# Altium schematic sheet Esquema_V2.SchDoc
size A3; SheetNumber: 1; SheetTotal: 2
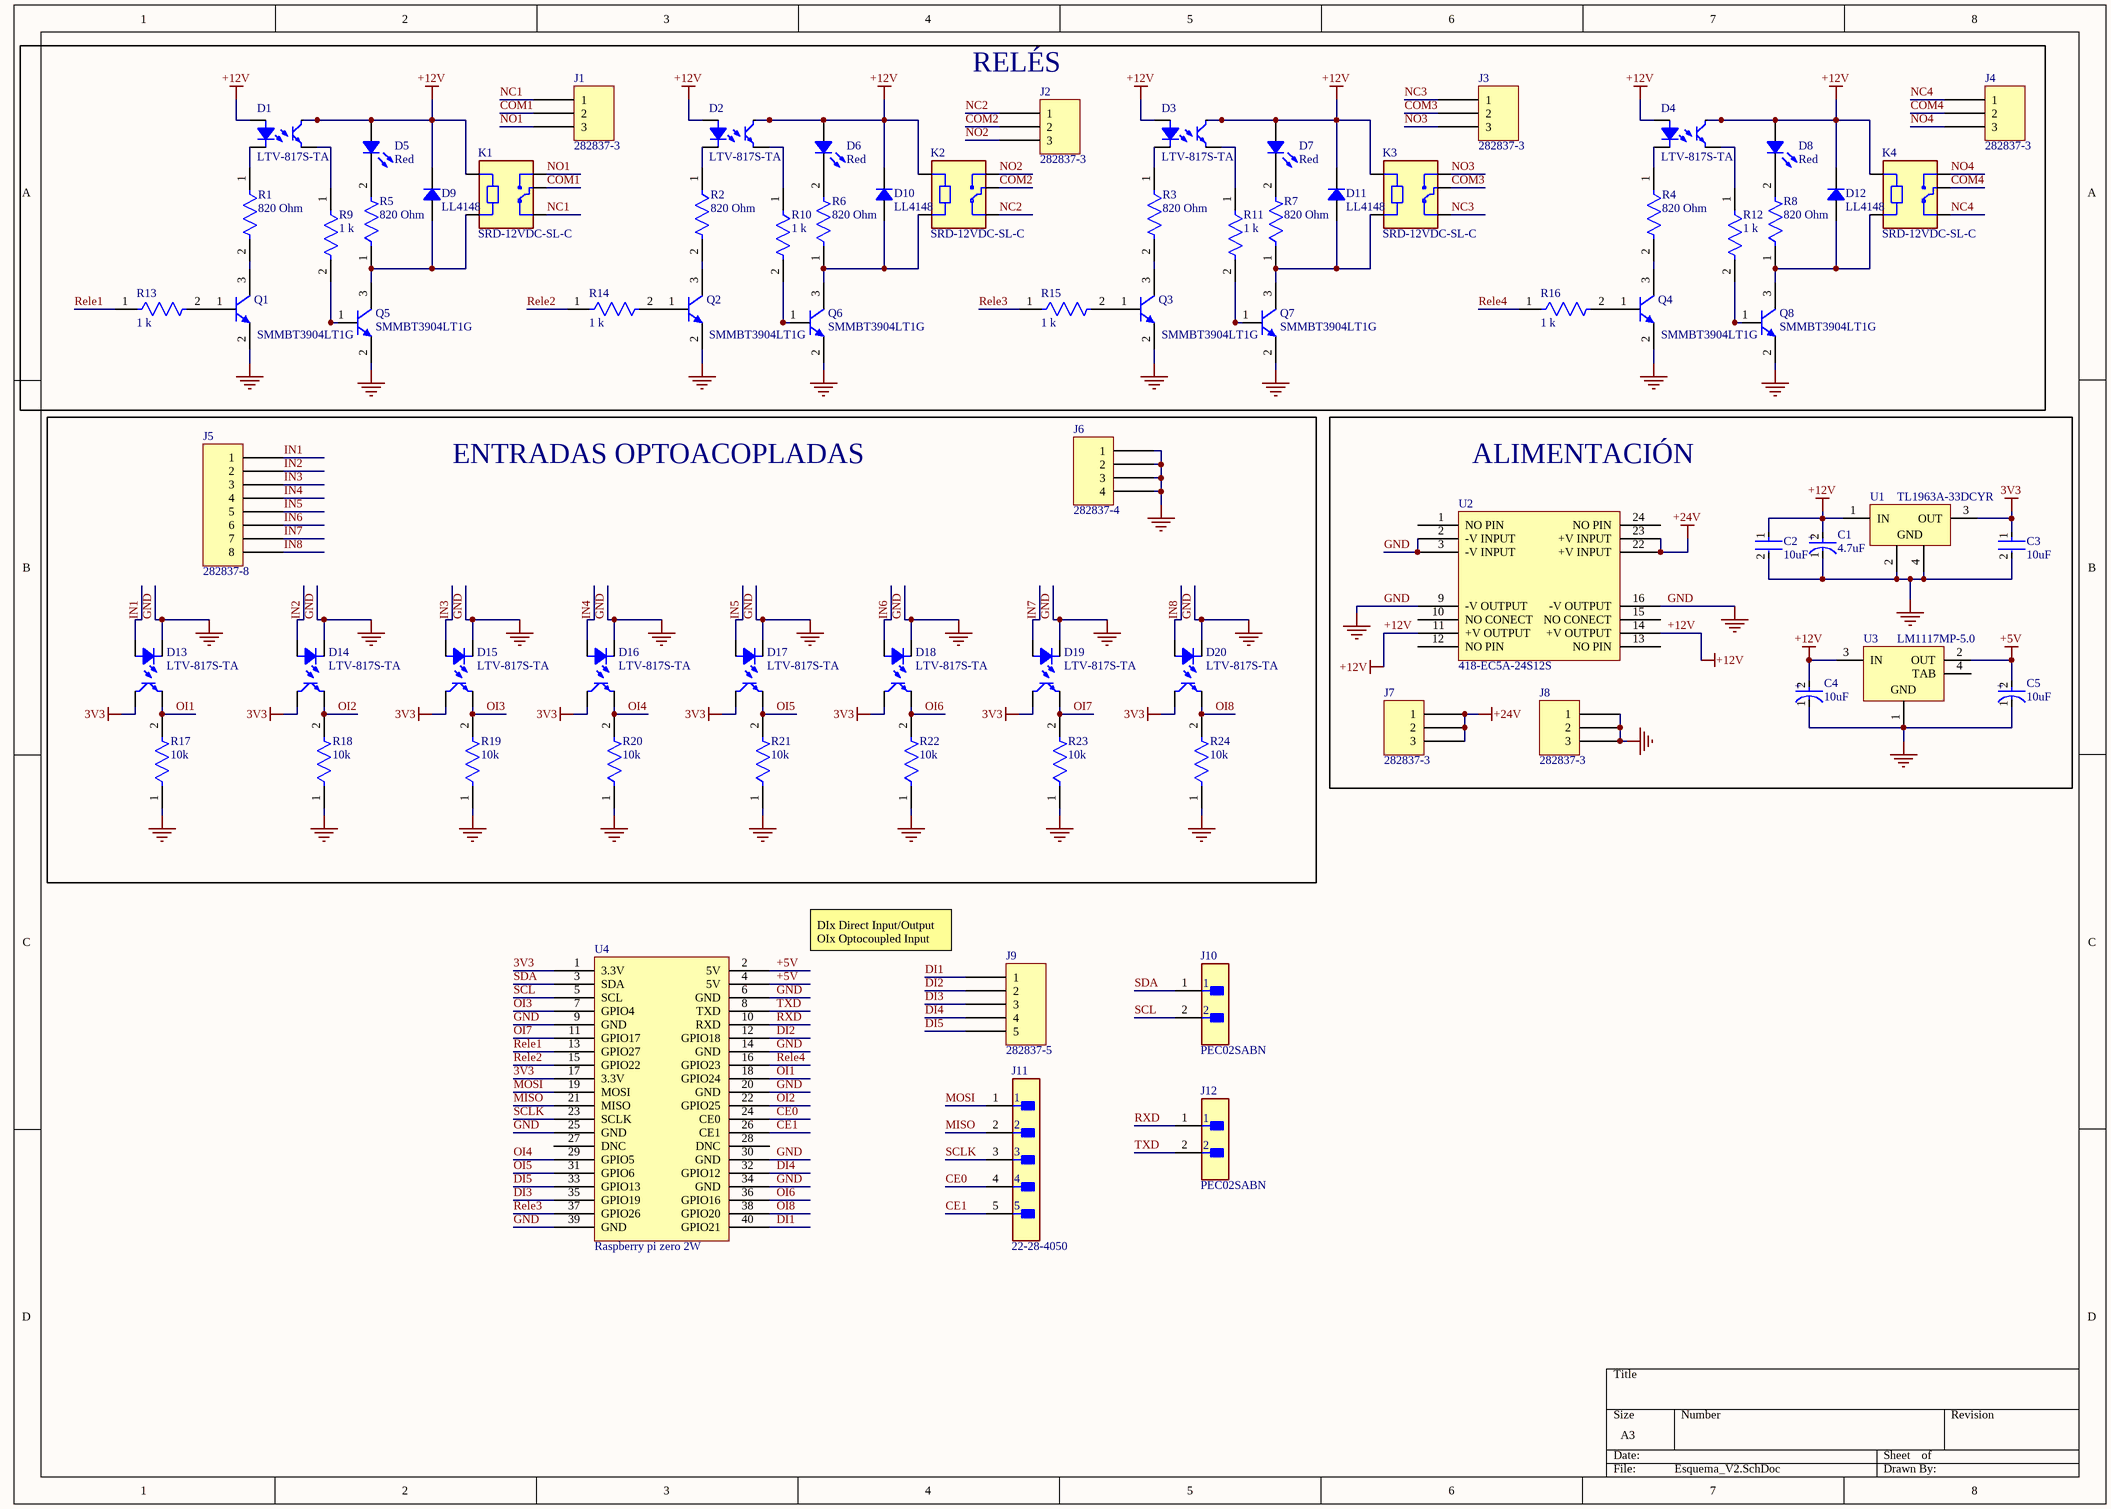
[diagram p0: Esquema_V2.SchDoc]

## Parts
C1  4.7uF  [FP-T491A475M016AT-MFG]
C2  10uF  [FP-C2012-125-0_2-IPC_B]
C3  10uF  [FP-C2012-125-0_2-IPC_B]
C4  10uF  [FP-TAJA-MFG]
C5  10uF  [FP-TAJA-MFG]
D1  LTV-817S-TA  [LITEON LTV-817]
D2  LTV-817S-TA  [LITEON LTV-817]
D3  LTV-817S-TA  [LITEON LTV-817]
D4  LTV-817S-TA  [LITEON LTV-817]
D5  Red  [LED 1206_3216 RED]
D6  Red  [LED 1206_3216 RED]
D7  Red  [LED 1206_3216 RED]
D8  Red  [LED 1206_3216 RED]
D9  LL4148  [SOD-80 MiniMELF]
D10  LL4148  [SOD-80 MiniMELF]
D11  LL4148  [SOD-80 MiniMELF]
D12  LL4148  [SOD-80 MiniMELF]
D13  LTV-817S-TA  [LITEON LTV-817]
D14  LTV-817S-TA  [LITEON LTV-817]
D15  LTV-817S-TA  [LITEON LTV-817]
D16  LTV-817S-TA  [LITEON LTV-817]
D17  LTV-817S-TA  [LITEON LTV-817]
D18  LTV-817S-TA  [LITEON LTV-817]
D19  LTV-817S-TA  [LITEON LTV-817]
D20  LTV-817S-TA  [LITEON LTV-817]
J1  282837-3  [TE 282837-3]
J2  282837-3  [TE 282837-3]
J3  282837-3  [TE 282837-3]
J4  282837-3  [TE 282837-3]
J5  282837-8  [TE 282837-8]
J6  282837-4  [TE 282837-4]
J7  282837-3  [TE 282837-3]
J8  282837-3  [TE 282837-3]
J9  282837-5  [TE 282837-5]
J10  PEC02SABN  [FP-PEC02SABN-MFG]
J11  22-28-4050  [FP-22-28-4050-MFG]
J12  PEC02SABN  [FP-PEC02SABN-MFG]
K1  SRD-12VDC-SL-C  [RELAY_SRD-05VDC-SL-C]
K2  SRD-12VDC-SL-C  [RELAY_SRD-05VDC-SL-C]
K3  SRD-12VDC-SL-C  [RELAY_SRD-05VDC-SL-C]
K4  SRD-12VDC-SL-C  [RELAY_SRD-05VDC-SL-C]
Q1  SMMBT3904LT1G  [ONSC-SOT-23-3-318-08_V]
Q2  SMMBT3904LT1G  [ONSC-SOT-23-3-318-08_V]
Q3  SMMBT3904LT1G  [ONSC-SOT-23-3-318-08_V]
Q4  SMMBT3904LT1G  [ONSC-SOT-23-3-318-08_V]
Q5  SMMBT3904LT1G  [ONSC-SOT-23-3-318-08_V]
Q6  SMMBT3904LT1G  [ONSC-SOT-23-3-318-08_V]
Q7  SMMBT3904LT1G  [ONSC-SOT-23-3-318-08_V]
Q8  SMMBT3904LT1G  [ONSC-SOT-23-3-318-08_V]
R1  820 Ohm  [FP-CRCW0603-HPe3-MFG]
R2  820 Ohm  [FP-CRCW0603-HPe3-MFG]
R3  820 Ohm  [FP-CRCW0603-HPe3-MFG]
R4  820 Ohm  [FP-CRCW0603-HPe3-MFG]
R5  820 Ohm  [FP-CRCW0603-HPe3-MFG]
R6  820 Ohm  [FP-CRCW0603-HPe3-MFG]
R7  820 Ohm  [FP-CRCW0603-HPe3-MFG]
R8  820 Ohm  [FP-CRCW0603-HPe3-MFG]
R9  1 k  [FP-MCT0603-IPC_C]
R10  1 k  [FP-MCT0603-IPC_C]
R11  1 k  [FP-MCT0603-IPC_C]
R12  1 k  [FP-MCT0603-IPC_C]
R13  1 k  [FP-MCT0603-IPC_C]
R14  1 k  [FP-MCT0603-IPC_C]
R15  1 k  [FP-MCT0603-IPC_C]
R16  1 k  [FP-MCT0603-IPC_C]
R17  10k  [FP-MCT0603-IPC_B]
R18  10k  [FP-MCT0603-IPC_B]
R19  10k  [FP-MCT0603-IPC_B]
R20  10k  [FP-MCT0603-IPC_B]
R21  10k  [FP-MCT0603-IPC_B]
R22  10k  [FP-MCT0603-IPC_B]
R23  10k  [FP-MCT0603-IPC_B]
R24  10k  [FP-MCT0603-IPC_B]
U1  TL1963A-33DCYR  [DCY0004A_N]
U2  418-EC5A-24S12S  [418-EC5A-24S12S]
U3  LM1117MP-5.0  [MP04A_N]
U4  Raspberry pi zero 2W  [PCBComponent_1]

## Blocks framed on the sheet
RELÉS: D1-D12 J1-J4 K1-K4 Q1-Q8 R1-R16
ENTRADAS OPTOACOPLADAS: D13-D20 J5 J6 R17-R24
ALIMENTACIÓN: C1-C5 J7 J8 U1-U3

## Nets
3V3: C3.1 D13.4 D14.4 D15.4 D16.4 D17.4 D18.4 D19.4 D20.4 U1.3(OUT) U4.1(3.3V) U4.17(3.3V)
+5V: C5.2(A) U3.2(OUT) U4.2(5V) U4.4(5V)
+12V: C1.2(A) C2.1 C4.2(A) D1.1 D1.4 D2.1 D2.4 D3.1 D3.4 D4.1 D4.4 D5.1 D6.1 D7.1 D8.1 D9.2 D10.2 D11.2 D12.2 K1.A1 K2.A1 K3.A1 K4.A1 U1.1(IN) U2.11(+V_OUTPUT) U2.14(+V_OUTPUT) U3.3(IN)
+24V: J7.1 J7.2 J7.3 U2.22(+V_INPUT) U2.23(+V_INPUT)
GND: C1.1(C) C2.2 C3.2 C4.1(C) C5.1(C) D13.2 D14.2 D15.2 D16.2 D17.2 D18.2 D19.2 D20.2 J6.1 J6.2 J6.3 J6.4 J8.1 J8.2 J8.3 Q1.2(E) Q2.2(E) Q3.2(E) Q4.2(E) Q5.2(E) Q6.2(E) Q7.2(E) Q8.2(E) R17.1 R18.1 R19.1 R20.1 R21.1 R22.1 R23.1 R24.1 U1.2(GND) U1.4(GND) U2.2(-V_INPUT) U2.3(-V_INPUT) U2.9(-V_OUTPUT) U2.16(-V_OUTPUT) U3.1(GND) U4.6(GND) U4.9(GND) U4.14(GND) U4.20(GND) U4.25(GND) U4.30(GND) U4.34(GND) U4.39(GND)
CE0: J11.4 U4.24(CE0)
CE1: J11.5 U4.26(CE1)
COM1: J1.2 K1.COM
COM2: J2.2 K2.COM
COM3: J3.2 K3.COM
COM4: J4.2 K4.COM
DI1: J9.1 U4.40(GPIO21)
DI2: J9.2 U4.12(GPIO18)
DI3: J9.3 U4.35(GPIO19)
DI4: J9.4 U4.32(GPIO12)
DI5: J9.5 U4.33(GPIO13)
IN1: D13.1 J5.1
IN2: D14.1 J5.2
IN3: D15.1 J5.3
IN4: D16.1 J5.4
IN5: D17.1 J5.5
IN6: D18.1 J5.6
IN7: D19.1 J5.7
IN8: D20.1 J5.8
MISO: J11.2 U4.21(MISO)
MOSI: J11.1 U4.19(MOSI)
NC1: J1.1 K1.NC
NC2: J2.1 K2.NC
NC3: J3.1 K3.NC
NC4: J4.1 K4.NC
NO1: J1.3 K1.NO
NO2: J2.3 K2.NO
NO3: J3.3 K3.NO
NO4: J4.3 K4.NO
OI1: D13.3 R17.2 U4.18(GPIO24)
OI2: D14.3 R18.2 U4.22(GPIO25)
OI3: D15.3 R19.2 U4.7(GPIO4)
OI4: D16.3 R20.2 U4.29(GPIO5)
OI5: D17.3 R21.2 U4.31(GPIO6)
OI6: D18.3 R22.2 U4.36(GPIO16)
OI7: D19.3 R23.2 U4.11(GPIO17)
OI8: D20.3 R24.2 U4.38(GPIO20)
Rele1: R13.1 U4.13(GPIO27)
Rele2: R14.1 U4.15(GPIO22)
Rele3: R15.1 U4.37(GPIO26)
Rele4: R16.1 U4.16(GPIO23)
RXD: J12.1 U4.10(RXD)
SCL: J10.2 U4.5(SCL)
SCLK: J11.3 U4.23(SCLK)
SDA: J10.1 U4.3(SDA)
TXD: J12.2 U4.8(TXD)
NetD1_2: D1.2 R1.1
NetD1_3: D1.3 R9.1
NetD2_2: D2.2 R2.1
NetD2_3: D2.3 R10.1
NetD3_2: D3.2 R3.1
NetD3_3: D3.3 R11.1
NetD4_2: D4.2 R4.1
NetD4_3: D4.3 R12.1
NetD5_2: D5.2 R5.2
NetD6_2: D6.2 R6.2
NetD7_2: D7.2 R7.2
NetD8_2: D8.2 R8.2
NetD9_1: D9.1 K1.A2 Q5.3(C) R5.1
NetD10_1: D10.1 K2.A2 Q6.3(C) R6.1
NetD11_1: D11.1 K3.A2 Q7.3(C) R7.1
NetD12_1: D12.1 K4.A2 Q8.3(C) R8.1
NetQ1_1: Q1.1(B) R13.2
NetQ1_3: Q1.3(C) R1.2
NetQ2_1: Q2.1(B) R14.2
NetQ2_3: Q2.3(C) R2.2
NetQ3_1: Q3.1(B) R15.2
NetQ3_3: Q3.3(C) R3.2
NetQ4_1: Q4.1(B) R16.2
NetQ4_3: Q4.3(C) R4.2
NetQ5_1: Q5.1(B) R9.2
NetQ6_1: Q6.1(B) R10.2
NetQ7_1: Q7.1(B) R11.2
NetQ8_1: Q8.1(B) R12.2

Not connected (* = marked no-connect by the designer): U2 1(NO_PIN) 10(NO_CONECT) 12(NO_PIN) 13(NO_PIN) 15(NO_CONECT) 24(NO_PIN); U3 4(TAB); U4 27(DNC) 28(DNC)

## Notes on the sheet
- DIx Direct Input/Output
  OIx Optocoupled Input
- (in symbol CMP-2000-07219-2) +
- (in symbol CMP-03017-000026-1) +

## Library data of the parts
C1 = CMP-03017-000026-1: T491A475M016AT CAP TANT 4.7UF 20% 16V 1206; Life (Hours): 2000Hour; ESR (Equivalent Series Resistance): 4R; Polarity: Polar; Leakage Current: 800nA; Dissipation Factor: 6%; Ripple Current: 137mA; Width: 0.063inch; Package Quantity: 2000; Voltage Rating: 16V; Series: T491; Depth: 1.6mm; Mount: Surface Mount; Voltage Rating (DC): 16V; Construction: Flat; Radiation Hardening: No; Case/Package: 1206; Features: General Purpose; Termination: SMD/SMT; Case Code (Imperial): 1206; Length: 3.2mm; Number of Pins: 2; RoHS Compliant: Yes; Case Code (Metric): 3216; Height: 1.8mm; REACH SVHC: No SVHC; Max Operating Temperature: 125°C; Packaging: Tape and Reel; Min Operating Temperature: -55°C; Capacitance: 4.7uF; Tolerance: 20%; Height - Seated (Max): 0.071inch; Lead Free: Lead Free
C2 C3 = CMP-08246-002675-1: C2012X5R1E106K125AB Multilayer Ceramic Capacitors 10μF ±10% 25V X5R SMD 0805; Packaging: Tape and Reel; Dielectric: X5R; Case/Package: 0805; Lead Free: Lead Free; Dielectric Material: Ceramic; Series: C; Termination: SMD/SMT; Voltage: 25V; Depth: 1.25mm; Max Operating Temperature: 85°C; Voltage Rating (DC): 25V; Resistor Type: Ceramic; Weight: 0.000194oz; Case Code (Metric): 2012; Height: 1.25mm; Mount: Surface Mount; Voltage Rating: 25V; Length: 2mm; REACH SVHC: No SVHC; Min Operating Temperature: -55°C; Case Code (Imperial): 0805; Thickness: 0.057inch; Width: 0.049inch; Tolerance: 10%; Capacitance: 10uF; Package Quantity: 1
C4 C5 = CMP-2000-07219-2: TAJA106M010RNJ 10uF 10V  ±20% 3Ω 1206  SMD Tantalum Capacitor; Polarity: Polar; ESR (Equivalent Series Resistance): 3R; Dissipation Factor: 6%; Leakage Current: 1uA; Construction: Flat; Packaging: Tape and Reel; Voltage Rating: 10V; Lead Free: Lead Free; Radiation Hardening: No; REACH SVHC: No SVHC; Termination: SMD/SMT; Case/Package: 1206; RoHS Compliant: Yes; Min Operating Temperature: -55°C; Depth: 1.6mm; Voltage Rating (DC): 10V; Series: TAJ; Capacitance: 10uF; Height: 1.6mm; Height - Seated (Max): 0.071inch; Tolerance: 20%; Package Quantity: 1; Voltage: 10V; Features: General Purpose; Max Operating Temperature: 125°C; Lead Pitch: 1.1mm; Dielectric Material: Tantalum; Width: 0.063inch; Mount: Surface Mount; Case Code (Metric): 3216; Case Code (Imperial): 1206; Length: 3.2mm; Number of Pins: 2
D1-D4 D13-D20 = LTV-817S-TA: OPTOISOLATR 5KV TRANSISTOR 4-SMD; Manufacturer: Lite-On Inc.; Current - DC Forward (If) (Max): 50mA; Current Transfer Ratio (Max): 600% @ 5mA; Current Transfer Ratio (Min): 50% @ 5mA; Input Type: DC; Number of Channels: 1; Rise / Fall Time (Typ): 4µs, 3µs; Vce Saturation (Max): 200mV; Voltage - Forward (Vf) (Typ): 1.2V; Voltage - Isolation: 5000Vrms; Voltage - Output (Max): 35V; Part Number: LTV-817S-TA; ComponentLink1Description: Datasheet; ComponentLink1URL: http://optoelectronics.liteon.com/upload/download/DS-70-96-0016/LTV-8X7%20series%20201610%20.pdf; ComponentLink2Description: DigiKey Link; ComponentLink2URL: http://digikey.com/product-detail/en/lite-on-inc/LTV-817S-TA/160-2038-1-ND/3711420; Current - Output / Channel: 50mA; Device Package: 4-SMD, Gull Wing; LastUpdated: 12/01/2020 21:59:02; Lifecycle Status: Active; Minimum Order: 1; Mounting Type: Surface Mount; Operating Temperature: -30°C ~ 110°C; Output Type: Transistor; Package / Case: 4-SMD, Gull Wing; Packaging: TapeAndReel; Part Status: Active; Price: 0.12; Series: -; Supplier 1: DigiKey; Supplier Part Number 1: 160-2038-1-ND; Supplier Device Package: 4-SMD
D5-D8 = LTST-C150KAKT: LED RED CLEAR SMD; Manufacturer: Lite-On Inc.; Configuration: Standard; Current - Test: 20mA; Lens Color: Colorless; Lens Size: 2.06mm x 1.60mm; Lens Style: Rectangle with Flat Top; Millicandela Rating: 55mcd; Viewing Angle: 130°; Voltage - Forward (Vf) (Typ): 2V; Wavelength - Dominant: 615nm; Wavelength - Peak: 621nm; Part Number: LTST-C150KAKT; Color: Red; ComponentLink1Description: Datasheet; ComponentLink1URL: //media.digikey.com/pdf/Data%20Sheets/Lite-On%20PDFs/LTST-C150KAKT.pdf; ComponentLink2Description: DigiKey Link; ComponentLink2URL: http://digikey.com/product-detail/en/lite-on-inc/LTST-C150KAKT/160-1402-1-ND/386755; Device Package: 1206 (3216 Metric); Height (Max): 1.10mm; LastUpdated: 03/06/2024 20:00:41; Lens Transparency: Clear; Lifecycle Status: Active; Minimum Order: 1; Mounting Type: Surface Mount; Package / Case: 1206 (3216 Metric); Packaging: TapeAndReel; PartId: 189; Part Status: Active; Price: 0.07; Series: -; Size / Dimension: 3.20mm L x 1.60mm W; Supplier 1: DigiKey; Supplier Part Number 1: 160-1402-1-ND; Value: Red
D9-D12 = LL4148: DIODE GEN PURP 100V 200MA SOD80; Manufacturer: ON Semiconductor; Current - Reverse Leakage @ Vr: 25nA @ 20V; Diode Type: Standard; Reverse Recovery Time (trr): 4ns; Speed: Small Signal =< 200mA (Io), Any Speed; Voltage - Forward (Vf) (Max) @ If: 1V @ 10mA; Part Number: LL4148; ComponentLink1Description: Datasheet; ComponentLink1URL: https://www.onsemi.com/pub/Collateral/LL4148-D.pdf; ComponentLink2Description: DigiKey Link; ComponentLink2URL: http://digikey.com/product-detail/en/on-semiconductor/LL4148/LL4148FSCT-ND/1923118; Current - Average Rectified (Io): 200mA; LastUpdated: 03/06/2024 20:05:39; Lifecycle Status: Active; Minimum Order: 1; Mounting Type: Surface Mount; Operating Temperature - Junction: -55°C ~ 175°C; Package / Case: DO-213AC, MINI-MELF, SOD-80; Packaging: TapeAndReel; PartId: 2621; Part Status: Active; Price: 0.02; Series: -; Supplier 1: DigiKey; Supplier Part Number 1: LL4148FSCT-ND; Supplier Device Package: SOD-80; Voltage - DC Reverse (Vr) (Max): 100V
J1-J4 J7 J8 = 282837-3: TERM BLK 3P SIDE ENT 5.08MM PCB; Manufacturer: TE Connectivity AMP Connectors; Current: 13.5 A; Mating Orientation: Horizontal with Board; Number of Levels: 1; Pitch: 0.200" (5.08mm); Positions Per Level: 3; Voltage: 300 V; Wire Gauge: 16-28 AWG; Wire Termination: Screw - Rising Cage Clamp; Part Number: 282837-3; Color: Green; ComponentLink1Description: Datasheet; ComponentLink1URL: https://www.te.com/commerce/DocumentDelivery/DDEController?Action=srchrtrv&DocNm=282837&DocType=Customer+Drawing&DocLang=English; ComponentLink2Description: DigiKey Link; ComponentLink2URL: https://www.digikey.com/en/products/detail/te-connectivity-amp-connectors/282837-3/2187974; Features: Interlocking (Side); LastUpdated: 21/06/2022 15:00:39; Lifecycle Status: Active; Minimum Order: 1; Mounting Type: Through Hole; Packaging: Tray; Part Status: Active; Price: 0.47; Series: Buchanan; Supplier 1: DigiKey; Supplier Part Number 1: A113321-ND
J5 = 282837-8: TERM BLK 8P SIDE ENT 5.08MM PCB; Manufacturer: TE Connectivity AMP Connectors; Current: 13.5 A; Mating Orientation: Horizontal with Board; Number of Levels: 1; Pitch: 0.200" (5.08mm); Positions Per Level: 8; Voltage: 300 V; Wire Gauge: 16-28 AWG; Wire Termination: Screw - Rising Cage Clamp; Part Number: 282837-8; Color: Green; ComponentLink1Description: Datasheet; ComponentLink1URL: https://www.te.com/commerce/DocumentDelivery/DDEController?Action=srchrtrv&DocNm=282837&DocType=Customer+Drawing&DocLang=English; ComponentLink2Description: DigiKey Link; ComponentLink2URL: https://www.digikey.com/en/products/detail/te-connectivity-amp-connectors/282837-8/2222331; Features: Interlocking (Side); LastUpdated: 21/06/2022 15:01:52; Lifecycle Status: Active; Minimum Order: 1; Mounting Type: Through Hole; Packaging: Bulk; Part Status: Active; Price: 1.64; Series: Buchanan; Supplier 1: DigiKey; Supplier Part Number 1: 282837-8-ND
J6 = 282837-4: TERM BLK 4P SIDE ENT 5.08MM PCB; Manufacturer: TE Connectivity AMP Connectors; Current: 13.5 A; Mating Orientation: Horizontal with Board; Number of Levels: 1; Pitch: 0.200" (5.08mm); Positions Per Level: 4; Voltage: 300 V; Wire Gauge: 16-28 AWG; Wire Termination: Screw - Rising Cage Clamp; Part Number: 282837-4; Color: Green; ComponentLink1Description: Datasheet; ComponentLink1URL: https://www.te.com/commerce/DocumentDelivery/DDEController?Action=srchrtrv&DocNm=282837&DocType=Customer+Drawing&DocLang=English; ComponentLink2Description: DigiKey Link; ComponentLink2URL: https://www.digikey.com/en/products/detail/te-connectivity-amp-connectors/282837-4/2187975; Features: Interlocking (Side); LastUpdated: 21/06/2022 15:00:53; Lifecycle Status: Active; Minimum Order: 1; Mounting Type: Through Hole; Packaging: Tray; Part Status: Active; Price: 0.62; Series: Buchanan; Supplier 1: DigiKey; Supplier Part Number 1: A124423-ND
J9 = 282837-5: TERM BLK 5P SIDE ENT 5.08MM PCB; Manufacturer: TE Connectivity AMP Connectors; Current: 13.5A; Mating Orientation: Horizontal with Board; Number of Levels: 1; Pitch: 0.200" (5.08mm); Positions Per Level: 5; Voltage: 300V; Wire Gauge: 16-28 AWG; Wire Termination: Screw - Rising Cage Clamp; Part Number: 282837-5; Color: Green; ComponentLink1Description: Datasheet; ComponentLink1URL: https://www.te.com/commerce/DocumentDelivery/DDEController?Action=srchrtrv&DocNm=282837&DocType=Customer+Drawing&DocLang=English; ComponentLink2Description: DigiKey Link; ComponentLink2URL: http://digikey.com/product-detail/en/te-connectivity-amp-connectors/282837-5/282837-5-ND/2259492; Features: Interlocking (Side); LastUpdated: 21/06/2022 15:01:10; Lifecycle Status: Active; Minimum Order: 1; Mounting Type: Through Hole; Packaging: Tray; Part Status: Active; Price: 1.77; Series: Buchanan; Supplier 1: DigiKey; Supplier Part Number 1: 282837-5-ND
J10 J12 = CMP-25680-000076-1: CONN HEADER VERT 2POS 2.54MM; Pitch: 0.1inch; Gender: Male; Number of Contacts: 2; Connector Type: Male Pin; Housing Color: Black; Insulation Color: Black; Housing Material: Plastic; Contact Type: Male Pin; Series: -; Flammability Rating: UL94 V-0; Max Operating Temperature: 125°C; Fastening Type: Pull; Contact Finish - Mating: TIN; Insulation Material: PBT; Contact Plating: Tin; Lead Free: Lead Free; Mount: Through Hole; Termination: Solder; Width: 2.54mm; Contact Material: Bronze; Color: Black; Number of Rows: 1; Packaging: Bulk; Length: 5.08mm; Min Operating Temperature: -65°C; Contact Shape: Square; Contact Mating Length: 0.23inch; RoHS Compliant: Yes; Package Quantity: 1; Height: 2.54mm; Number of Positions: 2
J11 = CMP-00257-00278173-1: 22-28-4050 KK® 254 Breakaway Header, Vertical, 5 Circuits, Tin (Sn) Plating, Mating Pin Length 6.09mm; NexarPartId: 278173; Voltage Rating: 250V; Number of Contacts: 5; Contact Resistance: 20mΩ; Gender: Male; Pitch: 2.54mm; Connector Type: Male Pin; Current Rating: 4A; Glow Wire Compliant: Non-compliant; Max Voltage Rating (DC): 250.25kV; Flammability Rating: UL94 V-0; Min Operating Temperature: 0°C; REACH SVHC: Unknown; Lead Free: Lead Free; Termination: Solder; RoHS: Compliant; Schedule B: 8536694040; Number of Circuits: 5; Mount: Through Hole; Lead Pitch: 2.54mm; Height: 2.29mm; Voltage Rating (DC): 250V; Max Operating Temperature: 75°C; Width: 2.49mm; Radiation Hardening: No; Contact Plating: Tin; Orientation: Vertical; Length: 12.7mm; Number of Rows: 1; Housing Material: Thermoplastic; Contact Material: Brass; Packaging: Bulk; Contact Mating Length: 6.096mm; Housing Color: Black; Color: Black; Number of Positions: 5
K1-K4 = SRD-05VDC-SL-C: 5V Trigger Relay Module For Arduino And Raspberry Pi 5V Trigger Relay Module For Arduino And Raspberry Pi; MF: Songle Relay; Check_prices: https://www.snapeda.com/parts/SRD-05VDC-SL-C/Songle+Relay/view-part/?ref=eda; Value: *; Availability: Not in stock; Price: None; Package: NON STANDARD-5 Songle Relay; MP: SRD-05VDC-SL-C; SnapEDA_Link: https://www.snapeda.com/parts/SRD-05VDC-SL-C/Songle+Relay/view-part/?ref=snap
Q1-Q8 = CMP-1048-00625-1: General Purpose Transistor, NPN Silicon, 3-Pin SOT-23, Pb-Free, Tape and Reel; Manufacturer: On Semiconductor; IC Continuous (A): 0.2; fT Min (MHz): 300; PackageDescription: 3-Pin Small Outline Transistor, Body 2.92 x 1.3 mm, Pitch 0.95 mm; Mounting Technology: Surface Mount; ComponentLink1Description: Manufacturer URL; DatasheetVersion: Rev. 12; PackageReference: SOT-23-3-318-08; ComponentLink1URL: http://www.onsemi.com/; ComponentLink3Description: Package Specification; RoHS: TRUE; PartNumber: SMMBT3904LT1G; Polarity: NPN; Packing: Tape and Reel; ComponentLink2URL: http://www.onsemi.cn/pub_link/Collateral/MMBT3904LT1-D.PDF; PackageVersion: Rev. AP, 11/2009; ComponentLink2Description: Datasheet; ComponentLink3URL: http://www.onsemi.cn/pub_link/Collateral/318-08.PDF
R1-R8 = CMP-02407-003128-1: RES Thick Film, 820Ω, 1%, 0.33W, 100ppm/°C, 0603; Voltage Rating: 75V; Max Power Dissipation: 250mW; Resistance: 820R; Temperature Coefficient: 100ppm/°C; Termination: SMD/SMT; Military Standard: Not; Features: Automotive AEC-Q200; Composition: Thick Film; Voltage Rating (DC): 75V; Contact Plating: Tin; Package Quantity: 1; Case Code (Metric): 1608; Width: 0.033inch; Case/Package: 0603; Packaging: Tape and Reel; Depth: 0.85mm; Lead Free: Lead Free; Tolerance: 1%; Length: 1.6mm; Power Rating: 250mW; Weight: 7.1E-05oz; Case Code (Imperial): 0603; Radiation Hardening: No; Number of Terminations: 2; Max Operating Temperature: 155°C; Height: 0.45mm; Min Operating Temperature: -55°C
R9-R16 = CMP-02407-000265-1: MCT0603PD1001DP500 RES SMD 100 OHM 1% 1/8W 0603; Resistance: 1kR; Temperature Coefficient: 25ppm/°C; Tolerance: 0.5%; Max Power Dissipation: 250mW; Case Code (Metric): 1608; Case Code (Imperial): 0603; Number of Terminations: 2; Case/Package: 0603; Features: Automotive AEC-Q200; Max Operating Temperature: 175°C; Min Operating Temperature: -55°C; Composition: Thin Film; Packaging: Tape and Reel
R17-R24 = CMP-02407-000530-1: MCT0603MD1002BP100 RES SMD 10k OHM 1% 1/8W 0603; Resistance: 10kR; Voltage Rating (DC): 75V; Max Power Dissipation: 125mW; Tolerance: 0.1%; Temperature Coefficient: 25ppm/°C; Max Operating Temperature: 155°C; Case/Package: 0603; Contact Plating: Tin; Military Standard: Not; Number of Terminations: 2; Min Operating Temperature: -55°C; Radiation Hardening: No; Lead Free: Lead Free; Case Code (Imperial): 0603; Length: 1.55mm; Voltage Rating: 75V; Height: 0.45mm; Features: Automotive AEC-Q200; Case Code (Metric): 1608; REACH SVHC: No SVHC; Packaging: Tape and Reel; Depth: 0.85mm; Width: 0.033inch; Package Quantity: 1; Composition: Thin Film; Power Rating: 125mW
U1 = CMP-0395-00535-2: Single Output Low Noise LDO, 1.5 A, Fixed 3.3 V Output, 2.1 to 20 V Input, 4-pin SOT-223 (DCY), -40 to 125 degC, Green (RoHS & no Sb/Br); Manufacturer: Texas Instruments; Vout Adj(Min)(V): 3.3; Vin(Max)(V): 20; SubFamily: Single Channel LDO; Iq(Typ)(mA): 1; Iout(Max)(A): 1.5; Vin(Min)(V): 2.1; Vdo(Typ)(mV): 340; Accuracy(%): 3; ComponentLink2Description: Datasheet; PackageVersion: 4202506/B; PackageReference: DCY0004A; ComponentLink1Description: Manufacturer URL; Eco-Plan: Green (RoHS & no Sb/Br); ComponentLink1URL: http://www.ti.com/; Fixed Output Options(V): 3.3; ComponentLink2URL: http://www.ti.com/general/docs/lit/getliterature.tsp?genericPartNumber=TL1963A-33&fileType=pdf; Vout Adj(Max)(V): 3.3; PackageDescription: 4-Pin Plastic Small Outline, Body 3.5 x 6.5 mm, Pitch 2.3 mm; ComponentLink3URL: http://www.ti.com/litv/pdf/mpds094a; DatasheetVersion: SLVS719F; PartNumber: TL1963A-33DCYR; Code_JEDEC: TO-261; Mounting Technology: Surface Mount; ComponentLink3Description: Package Specification
U3 = CMP-0062-01640-3: 800mA Low-Dropout Linear Regulator, 4-pin SOT-223; Manufacturer: National Semiconductor; CompType: LDO IC; PackageTopMarking: XYTT*N06A; High-Reliability: Y; PowerWise: N; Code_IPC: SOT223-4; PackageVersion: revB, Apr-2003; RoHS: N; Code_JEDEC: TO-261-AA; PinCount: 4; ComponentLink1URL: http://www.national.com/; ComponentLink4URL: http://www.national.com/packaging/folders/mp04a.html; RevisionNote: SCH symbol layout adjusted; PackageDescription: Molded SOT-223, 6.50 x 3.56 x 1.6mm Body, 4 Lead, 2.3mm Pitch; DatasheetVersion: Apr-2006; ComponentLink3URL: http://www.national.com/pf/LM/LM1117.html; ComponentLink2URL: http://www.national.com/ds/LM/LM1117.pdf; PartNumber: LM1117MP-5.0; ComponentLink2Description: LM1117 Datasheet; ComponentLink3Description: LM1117 Web Page; ComponentLink4Description: MP04A Package Page; PackageReference: MP04A; ComponentLink1Description: Manufacturer URL